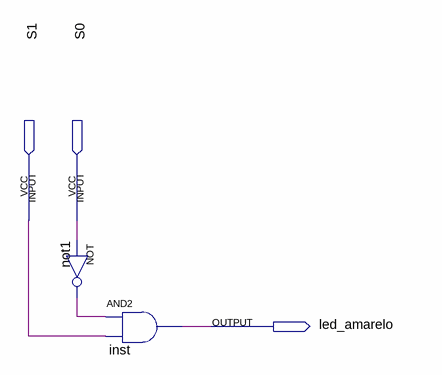
[diagram p0: schematic sheet]
// Quartus schematic saida_amarelo.bdf as structural Verilog: 2 symbols, 3 pins
module saida_amarelo (
  input  S1,
  input  S0,
  output led_amarelo
);

  wire not1_out;

  not not1 (not1_out, S0);
  and inst (led_amarelo, not1_out, S1);
endmodule
